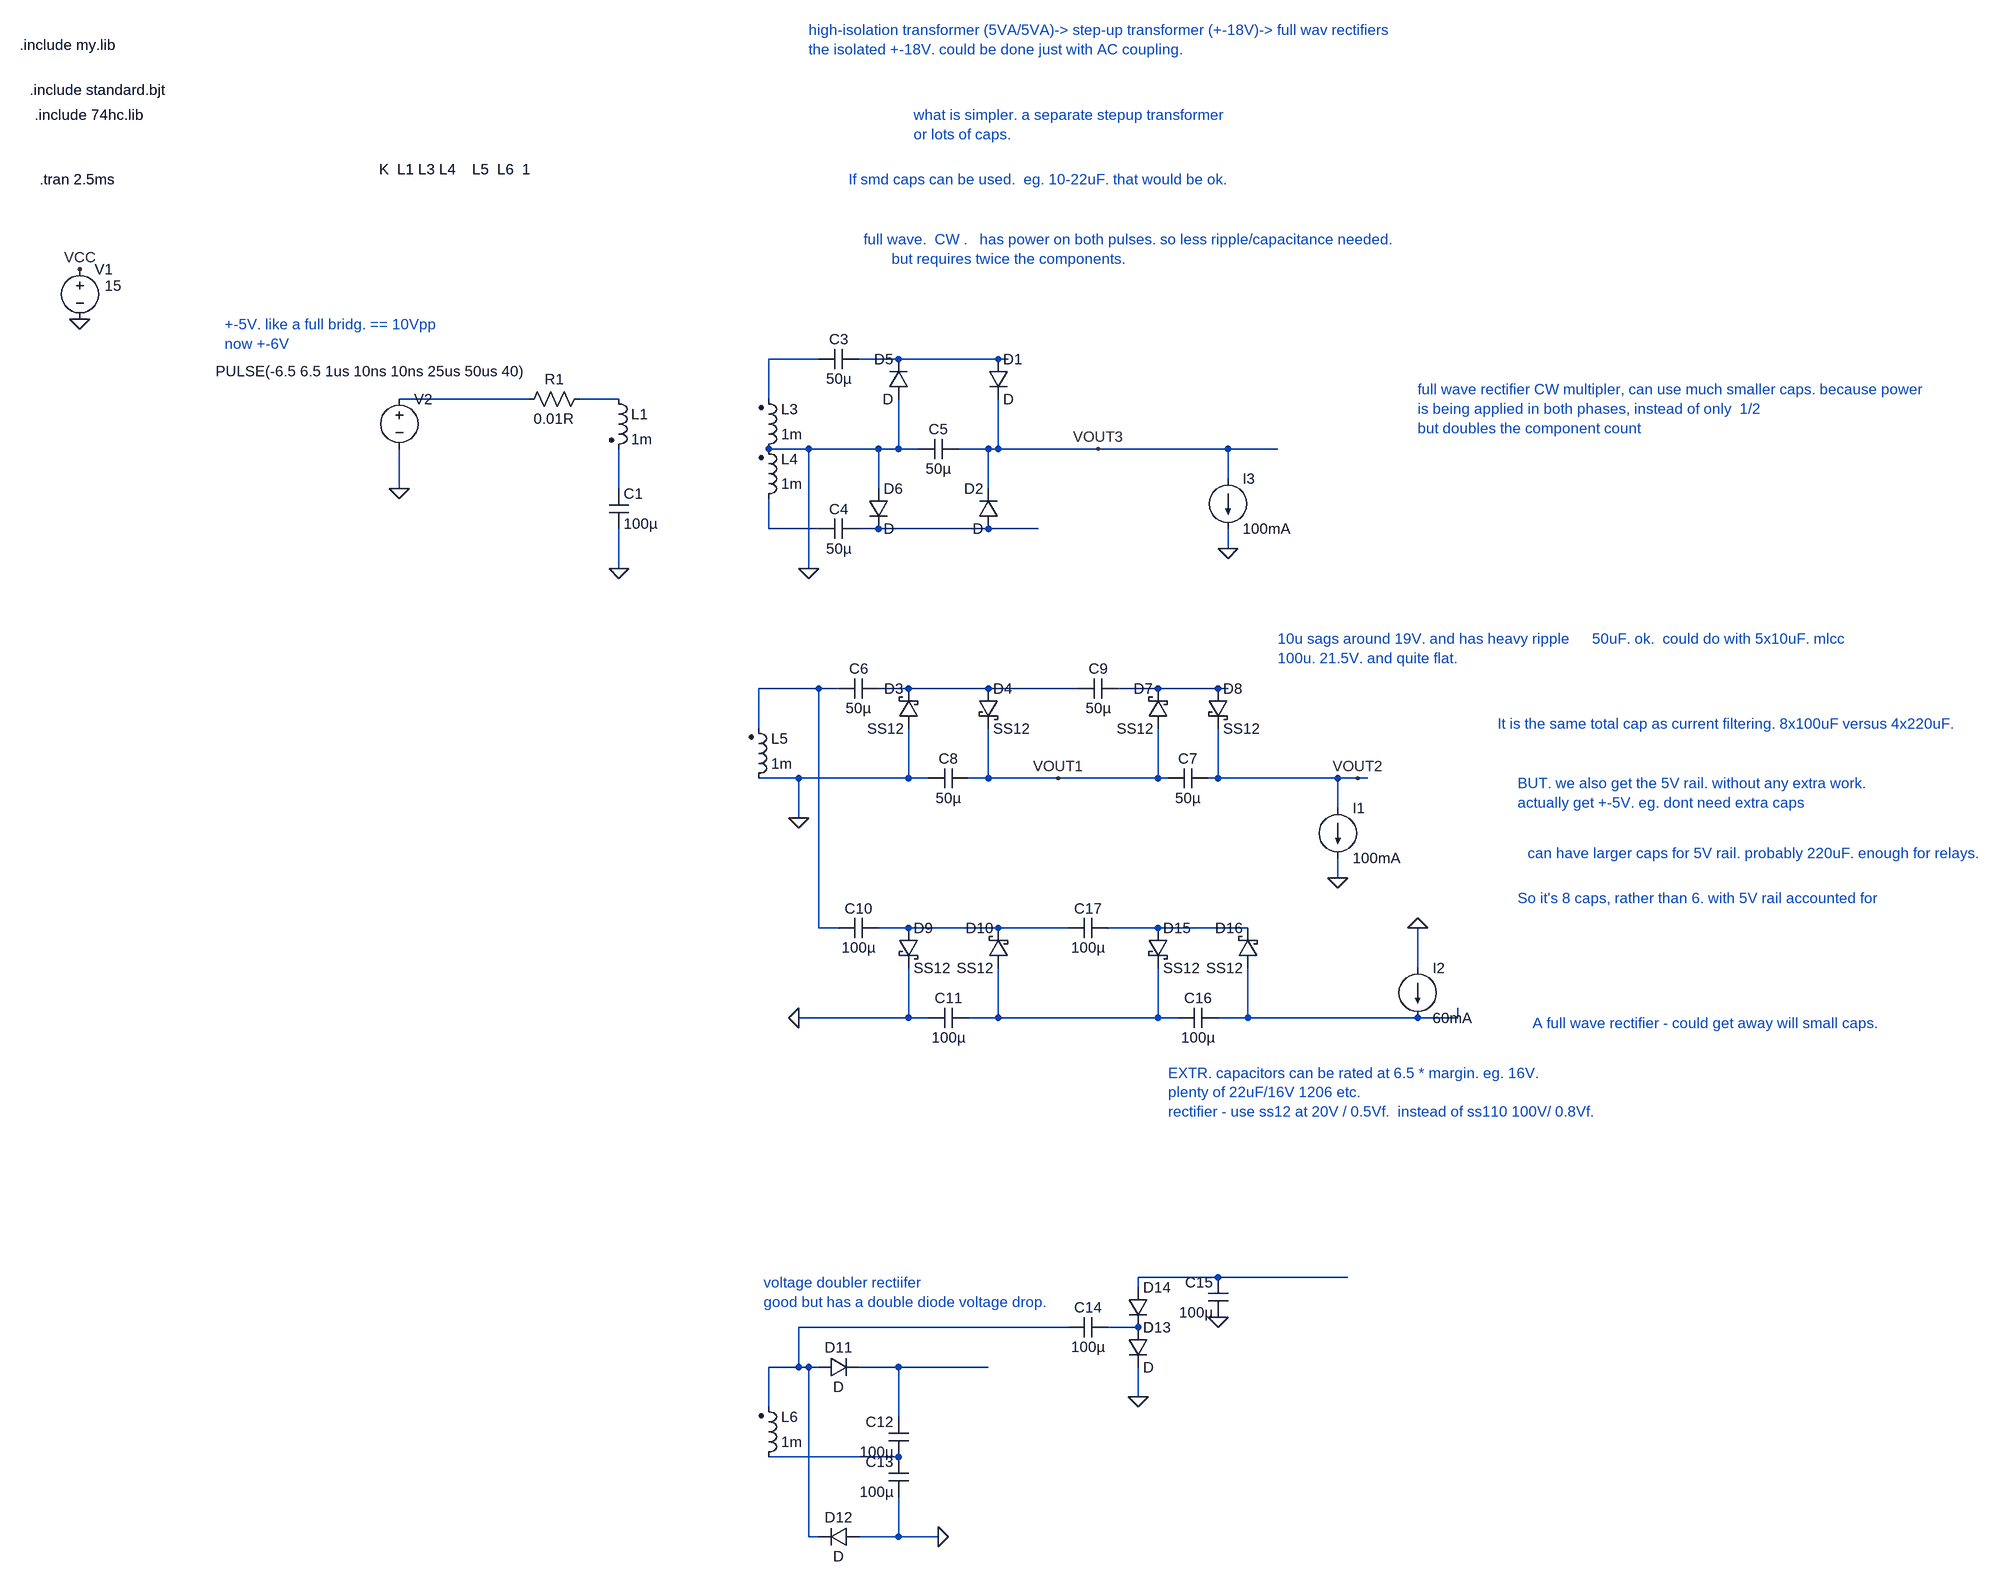
[diagram p0: schematic Draft25.asc]
Draft25.asc, the LTspice schematic file:
Version 4
SHEET 1 5720 1740
WIRE 1824 -192 1744 -192
WIRE 1952 -192 1888 -192
WIRE 2112 -192 1952 -192
WIRE 2128 -192 2112 -192
WIRE 1360 -128 1152 -128
WIRE 1504 -128 1440 -128
WIRE 1744 -128 1744 -192
WIRE 1808 -48 1744 -48
WIRE 1920 -48 1808 -48
WIRE 1952 -48 1952 -128
WIRE 1952 -48 1920 -48
WIRE 1984 -48 1952 -48
WIRE 2096 -48 2048 -48
WIRE 2112 -48 2112 -128
WIRE 2112 -48 2096 -48
WIRE 2272 -48 2112 -48
WIRE 2480 -48 2272 -48
WIRE 2560 -48 2480 -48
WIRE 2480 0 2480 -48
WIRE 1152 16 1152 -48
WIRE 1504 16 1504 -48
WIRE 1920 16 1920 -48
WIRE 2096 16 2096 -48
WIRE 1744 80 1744 32
WIRE 1824 80 1744 80
WIRE 1920 80 1888 80
WIRE 2096 80 1920 80
WIRE 2176 80 2096 80
WIRE 2480 112 2480 80
WIRE 1504 144 1504 80
WIRE 1808 144 1808 -48
WIRE 1824 336 1728 336
WIRE 1856 336 1824 336
WIRE 1968 336 1920 336
WIRE 2096 336 1968 336
WIRE 2240 336 2096 336
WIRE 2368 336 2304 336
WIRE 2464 336 2368 336
WIRE 2480 336 2464 336
WIRE 1728 400 1728 336
WIRE 1792 480 1728 480
WIRE 1968 480 1968 400
WIRE 1968 480 1792 480
WIRE 2000 480 1968 480
WIRE 2096 480 2096 400
WIRE 2096 480 2064 480
WIRE 2208 480 2096 480
WIRE 2368 480 2368 400
WIRE 2368 480 2208 480
WIRE 2384 480 2368 480
WIRE 2464 480 2464 400
WIRE 2464 480 2448 480
WIRE 2656 480 2464 480
WIRE 2688 480 2656 480
WIRE 2704 480 2688 480
WIRE 2656 528 2656 480
WIRE 1792 544 1792 480
WIRE 2656 640 2656 608
WIRE 1824 720 1824 336
WIRE 1856 720 1824 720
WIRE 1968 720 1920 720
WIRE 2112 720 1968 720
WIRE 2224 720 2112 720
WIRE 2368 720 2288 720
WIRE 2512 720 2368 720
WIRE 2784 784 2784 720
WIRE 1968 864 1968 784
WIRE 1968 864 1792 864
WIRE 2000 864 1968 864
WIRE 2112 864 2112 784
WIRE 2112 864 2064 864
WIRE 2368 864 2368 784
WIRE 2368 864 2112 864
WIRE 2400 864 2368 864
WIRE 2512 864 2512 784
WIRE 2512 864 2464 864
WIRE 2784 864 2512 864
WIRE 2848 864 2848 848
WIRE 2848 864 2784 864
WIRE 2464 1280 2336 1280
WIRE 2672 1280 2464 1280
WIRE 2336 1296 2336 1280
WIRE 2224 1360 1792 1360
WIRE 2336 1360 2288 1360
WIRE 1792 1424 1792 1360
WIRE 1792 1424 1744 1424
WIRE 1808 1424 1792 1424
WIRE 1824 1424 1808 1424
WIRE 1952 1424 1888 1424
WIRE 2096 1424 1952 1424
WIRE 2336 1472 2336 1424
WIRE 1744 1488 1744 1424
WIRE 1952 1504 1952 1424
WIRE 1952 1568 1744 1568
WIRE 1808 1696 1808 1424
WIRE 1824 1696 1808 1696
WIRE 1952 1696 1952 1632
WIRE 1952 1696 1888 1696
WIRE 2016 1696 1952 1696
FLAG 1808 144 0
FLAG 640 -256 0
FLAG 640 -336 VCC
FLAG 1504 144 0
FLAG 1792 544 0
FLAG 2208 480 VOUT1
FLAG 2688 480 VOUT2
FLAG 2272 -48 VOUT3
FLAG 1792 864 0
FLAG 2016 1696 0
FLAG 2336 1472 0
FLAG 2464 1344 0
FLAG 2656 640 0
FLAG 2784 720 0
FLAG 2480 112 0
FLAG 1152 16 0
SYMBOL ind2 1728 -32 M180
WINDOW 0 36 80 Left 2
WINDOW 3 36 40 Left 2
SYMATTR InstName L3
SYMATTR Value 1m
SYMATTR Type ind
SYMBOL diode 1968 -128 R180
WINDOW 0 24 64 Left 2
WINDOW 3 24 0 Left 2
SYMATTR InstName D5
SYMBOL diode 1904 16 R0
SYMATTR InstName D6
SYMBOL ind2 1728 48 M180
WINDOW 0 36 80 Left 2
WINDOW 3 36 40 Left 2
SYMATTR InstName L4
SYMATTR Value 1m
SYMATTR Type ind
SYMBOL voltage 640 -352 R0
WINDOW 123 0 0 Left 0
WINDOW 39 0 0 Left 0
WINDOW 3 40 42 Left 2
SYMATTR Value 15
SYMATTR InstName V1
SYMBOL ind2 1488 -144 R0
SYMATTR InstName L1
SYMATTR Value 1m
SYMATTR Type ind
SYMBOL voltage 1152 -144 R0
WINDOW 123 0 0 Left 0
WINDOW 39 0 0 Left 0
WINDOW 3 -294 -29 Left 2
SYMATTR Value PULSE(-6.5 6.5 1us 10ns 10ns 25us 50us 40)
SYMATTR InstName V2
SYMBOL cap 1888 -208 R90
WINDOW 0 0 32 VBottom 2
WINDOW 3 32 32 VTop 2
SYMATTR InstName C3
SYMATTR Value 50µ
SYMBOL cap 1888 64 R90
WINDOW 0 0 32 VBottom 2
WINDOW 3 32 32 VTop 2
SYMATTR InstName C4
SYMATTR Value 50µ
SYMBOL cap 1984 -32 R270
WINDOW 0 32 32 VTop 2
WINDOW 3 0 32 VBottom 2
SYMATTR InstName C5
SYMATTR Value 50µ
SYMBOL diode 2096 -192 R0
SYMATTR InstName D1
SYMBOL diode 2112 80 R180
WINDOW 0 24 64 Left 2
WINDOW 3 24 0 Left 2
SYMATTR InstName D2
SYMBOL ind2 1712 496 M180
WINDOW 0 36 80 Left 2
WINDOW 3 36 40 Left 2
SYMATTR InstName L5
SYMATTR Value 1m
SYMATTR Type ind
SYMBOL schottky 1984 400 R180
WINDOW 0 24 64 Left 2
WINDOW 3 24 0 Left 2
SYMATTR InstName D3
SYMATTR Value SS12
SYMATTR Description Diode
SYMATTR Type diode
SYMBOL cap 1920 320 R90
WINDOW 0 0 32 VBottom 2
WINDOW 3 32 32 VTop 2
SYMATTR InstName C6
SYMATTR Value 50µ
SYMBOL cap 2000 496 R270
WINDOW 0 32 32 VTop 2
WINDOW 3 0 32 VBottom 2
SYMATTR InstName C8
SYMATTR Value 50µ
SYMBOL cap 2384 496 R270
WINDOW 0 32 32 VTop 2
WINDOW 3 0 32 VBottom 2
SYMATTR InstName C7
SYMATTR Value 50µ
SYMBOL cap 2304 320 R90
WINDOW 0 0 32 VBottom 2
WINDOW 3 32 32 VTop 2
SYMATTR InstName C9
SYMATTR Value 50µ
SYMBOL schottky 2080 336 R0
SYMATTR InstName D4
SYMATTR Value SS12
SYMATTR Description Diode
SYMATTR Type diode
SYMBOL schottky 2384 400 R180
WINDOW 0 24 64 Left 2
WINDOW 3 24 0 Left 2
SYMATTR InstName D7
SYMATTR Value SS12
SYMATTR Description Diode
SYMATTR Type diode
SYMBOL schottky 2448 336 R0
SYMATTR InstName D8
SYMATTR Value SS12
SYMATTR Description Diode
SYMATTR Type diode
SYMBOL schottky 1952 720 R0
SYMATTR InstName D9
SYMATTR Value SS12
SYMATTR Description Diode
SYMATTR Type diode
SYMBOL cap 1920 704 R90
WINDOW 0 0 32 VBottom 2
WINDOW 3 32 32 VTop 2
SYMATTR InstName C10
SYMATTR Value 100µ
SYMBOL cap 2000 880 R270
WINDOW 0 32 32 VTop 2
WINDOW 3 0 32 VBottom 2
SYMATTR InstName C11
SYMATTR Value 100µ
SYMBOL schottky 2128 784 R180
WINDOW 0 24 64 Left 2
WINDOW 3 24 0 Left 2
SYMATTR InstName D10
SYMATTR Value SS12
SYMATTR Description Diode
SYMATTR Type diode
SYMBOL ind2 1728 1584 M180
WINDOW 0 36 80 Left 2
WINDOW 3 36 40 Left 2
SYMATTR InstName L6
SYMATTR Value 1m
SYMATTR Type ind
SYMBOL diode 1824 1440 R270
WINDOW 0 32 32 VTop 2
WINDOW 3 0 32 VBottom 2
SYMATTR InstName D11
SYMBOL diode 1888 1680 R90
WINDOW 0 0 32 VBottom 2
WINDOW 3 32 32 VTop 2
SYMATTR InstName D12
SYMBOL cap 1968 1568 R180
WINDOW 0 24 56 Left 2
WINDOW 3 24 8 Left 2
SYMATTR InstName C12
SYMATTR Value 100µ
SYMBOL cap 1968 1632 R180
WINDOW 0 24 56 Left 2
WINDOW 3 24 8 Left 2
SYMATTR InstName C13
SYMATTR Value 100µ
SYMBOL cap 2224 1376 R270
WINDOW 0 32 32 VTop 2
WINDOW 3 0 32 VBottom 2
SYMATTR InstName C14
SYMATTR Value 100µ
SYMBOL diode 2320 1360 R0
SYMATTR InstName D13
SYMBOL diode 2320 1296 R0
SYMATTR InstName D14
SYMBOL cap 2480 1344 R180
WINDOW 0 24 56 Left 2
WINDOW 3 24 8 Left 2
SYMATTR InstName C15
SYMATTR Value 100µ
SYMBOL current 2656 528 R0
WINDOW 123 0 0 Left 0
WINDOW 39 0 0 Left 0
SYMATTR InstName I1
SYMATTR Value 100mA
SYMBOL schottky 2352 720 R0
SYMATTR InstName D15
SYMATTR Value SS12
SYMATTR Description Diode
SYMATTR Type diode
SYMBOL cap 2400 880 R270
WINDOW 0 32 32 VTop 2
WINDOW 3 0 32 VBottom 2
SYMATTR InstName C16
SYMATTR Value 100µ
SYMBOL schottky 2528 784 R180
WINDOW 0 24 64 Left 2
WINDOW 3 24 0 Left 2
SYMATTR InstName D16
SYMATTR Value SS12
SYMATTR Description Diode
SYMATTR Type diode
SYMBOL cap 2288 704 R90
WINDOW 0 0 32 VBottom 2
WINDOW 3 32 32 VTop 2
SYMATTR InstName C17
SYMATTR Value 100µ
SYMBOL current 2784 784 R0
WINDOW 123 0 0 Left 0
WINDOW 39 0 0 Left 0
SYMATTR InstName I2
SYMATTR Value 60mA
SYMBOL current 2480 0 R0
WINDOW 123 0 0 Left 0
WINDOW 39 0 0 Left 0
SYMATTR InstName I3
SYMATTR Value 100mA
SYMBOL cap 1488 16 R0
SYMATTR InstName C1
SYMATTR Value 100µ
SYMBOL res 1456 -144 R90
WINDOW 0 0 56 VBottom 2
WINDOW 3 32 56 VTop 2
SYMATTR InstName R1
SYMATTR Value 0.01R
TEXT 576 -480 Left 2 !.tran 2.5ms
TEXT 1120 -496 Left 2 !K  L1 L3 L4    L5  L6  1
TEXT 560 -624 Left 2 !.include standard.bjt
TEXT 544 -696 Left 2 !.include my.lib
TEXT 568 -584 Left 2 !.include 74hc.lib
TEXT 872 -248 Left 2 ;+-5V. like a full bridg. == 10Vpp\nnow +-6V
TEXT 1896 -384 Left 2 ;full wave.  CW .   has power on both pulses. so less ripple/capacitance needed.\n       but requires twice the components.
TEXT 1736 1288 Left 2 ;voltage doubler rectiifer\ngood but has a double diode voltage drop.
TEXT 1976 -584 Left 2 ;what is simpler. a separate stepup transformer\nor lots of caps.
TEXT 1808 -720 Left 2 ;high-isolation transformer (5VA/5VA)-> step-up transformer (+-18V)-> full wav rectifiers\nthe isolated +-18V. could be done just with AC coupling.
TEXT 1872 -480 Left 2 ;If smd caps can be used.  eg. 10-22uF. that would be ok.
TEXT 2560 256 Left 2 ;10u sags around 19V. and has heavy ripple\n100u. 21.5V. and quite flat.
TEXT 2912 392 Left 2 ;It is the same total cap as current filtering. 8x100uF versus 4x220uF.
TEXT 2944 488 Left 2 ;BUT. we also get the 5V rail. without any extra work.\nactually get +-5V. eg. dont need extra caps
TEXT 2960 600 Left 2 ;can have larger caps for 5V rail. probably 220uF. enough for relays.
TEXT 2944 672 Left 2 ;So it's 8 caps, rather than 6. with 5V rail accounted for
TEXT 3064 256 Left 2 ;50uF. ok.  could do with 5x10uF. mlcc
TEXT 2384 952 Left 2 ;EXTR. capacitors can be rated at 6.5 * margin. eg. 16V.\nplenty of 22uF/16V 1206 etc.\nrectifier - use ss12 at 20V / 0.5Vf.  instead of ss110 100V/ 0.8Vf.
TEXT 2968 872 Left 2 ;A full wave rectifier - could get away will small caps.
TEXT 2784 -144 Left 2 ;full wave rectifier CW multipler, can use much smaller caps. because power\nis being applied in both phases, instead of only  1/2\nbut doubles the component count

The netlist it stands for:
* Draft25.asc
L3 0 N001 1m
D5 0 N002 D
D6 0 N007 D
L4 N006 0 1m
V1 VCC 0 15
L1 N004 N005 1m
V2 N003 0 PULSE(-6.5 6.5 1us 10ns 10ns 25us 50us 40)
C3 N002 N001 50µ
C4 N007 N006 50µ
C5 0 VOUT3 50µ
D1 N002 VOUT3 D
D2 N007 VOUT3 D
L5 0 N008 1m
D3 0 N009 SS12
C6 N009 N008 50µ
C8 0 VOUT1 50µ
C7 VOUT1 VOUT2 50µ
C9 N010 N009 50µ
D4 N009 VOUT1 SS12
D7 VOUT1 N010 SS12
D8 N010 VOUT2 SS12
D9 N011 0 SS12
C10 N011 N008 100µ
C11 0 N013 100µ
D10 N013 N011 SS12
L6 N019 N016 1m
D11 N016 N018 D
D12 0 N016 D
C12 N019 N018 100µ
C13 0 N019 100µ
C14 N016 N017 100µ
D13 N017 0 D
D14 N015 N017 D
C15 0 N015 100µ
I1 VOUT2 0 100mA
D15 N012 N013 SS12
C16 N013 N014 100µ
D16 N014 N012 SS12
C17 N012 N011 100µ
I2 0 N014 60mA
I3 VOUT3 0 100mA
C1 N005 0 100µ
R1 N004 N003 0.01R
.model D D
.lib standard.dio
.tran 2.5ms
K  L1 L3 L4    L5  L6  1
.include standard.bjt
.include my.lib
.include 74hc.lib
* +-5V. like a full bridg. == 10Vpp
* now +-6V
* full wave.  CW .   has power on both pulses. so less ripple/capacitance needed.
*        but requires twice the components.
* voltage doubler rectiifer
* good but has a double diode voltage drop.
* what is simpler. a separate stepup transformer
* or lots of caps.
* high-isolation transformer (5VA/5VA)-> step-up transformer (+-18V)-> full wav rectifiers
* the isolated +-18V. could be done just with AC coupling.
* If smd caps can be used.  eg. 10-22uF. that would be ok.
* 10u sags around 19V. and has heavy ripple
* 100u. 21.5V. and quite flat.
* It is the same total cap as current filtering. 8x100uF versus 4x220uF.
* BUT. we also get the 5V rail. without any extra work.
* actually get +-5V. eg. dont need extra caps
* can have larger caps for 5V rail. probably 220uF. enough for relays.
* So it's 8 caps, rather than 6. with 5V rail accounted for
* 50uF. ok.  could do with 5x10uF. mlcc
* EXTR. capacitors can be rated at 6.5 * margin. eg. 16V.
* plenty of 22uF/16V 1206 etc.
* rectifier - use ss12 at 20V / 0.5Vf.  instead of ss110 100V/ 0.8Vf.
* A full wave rectifier - could get away will small caps.
* full wave rectifier CW multipler, can use much smaller caps. because power
* is being applied in both phases, instead of only  1/2
* but doubles the component count
.backanno
.end